# EAGLE design Actuator (EAGLE 9.6.2)

## Sheet 1 of 3: Connectors
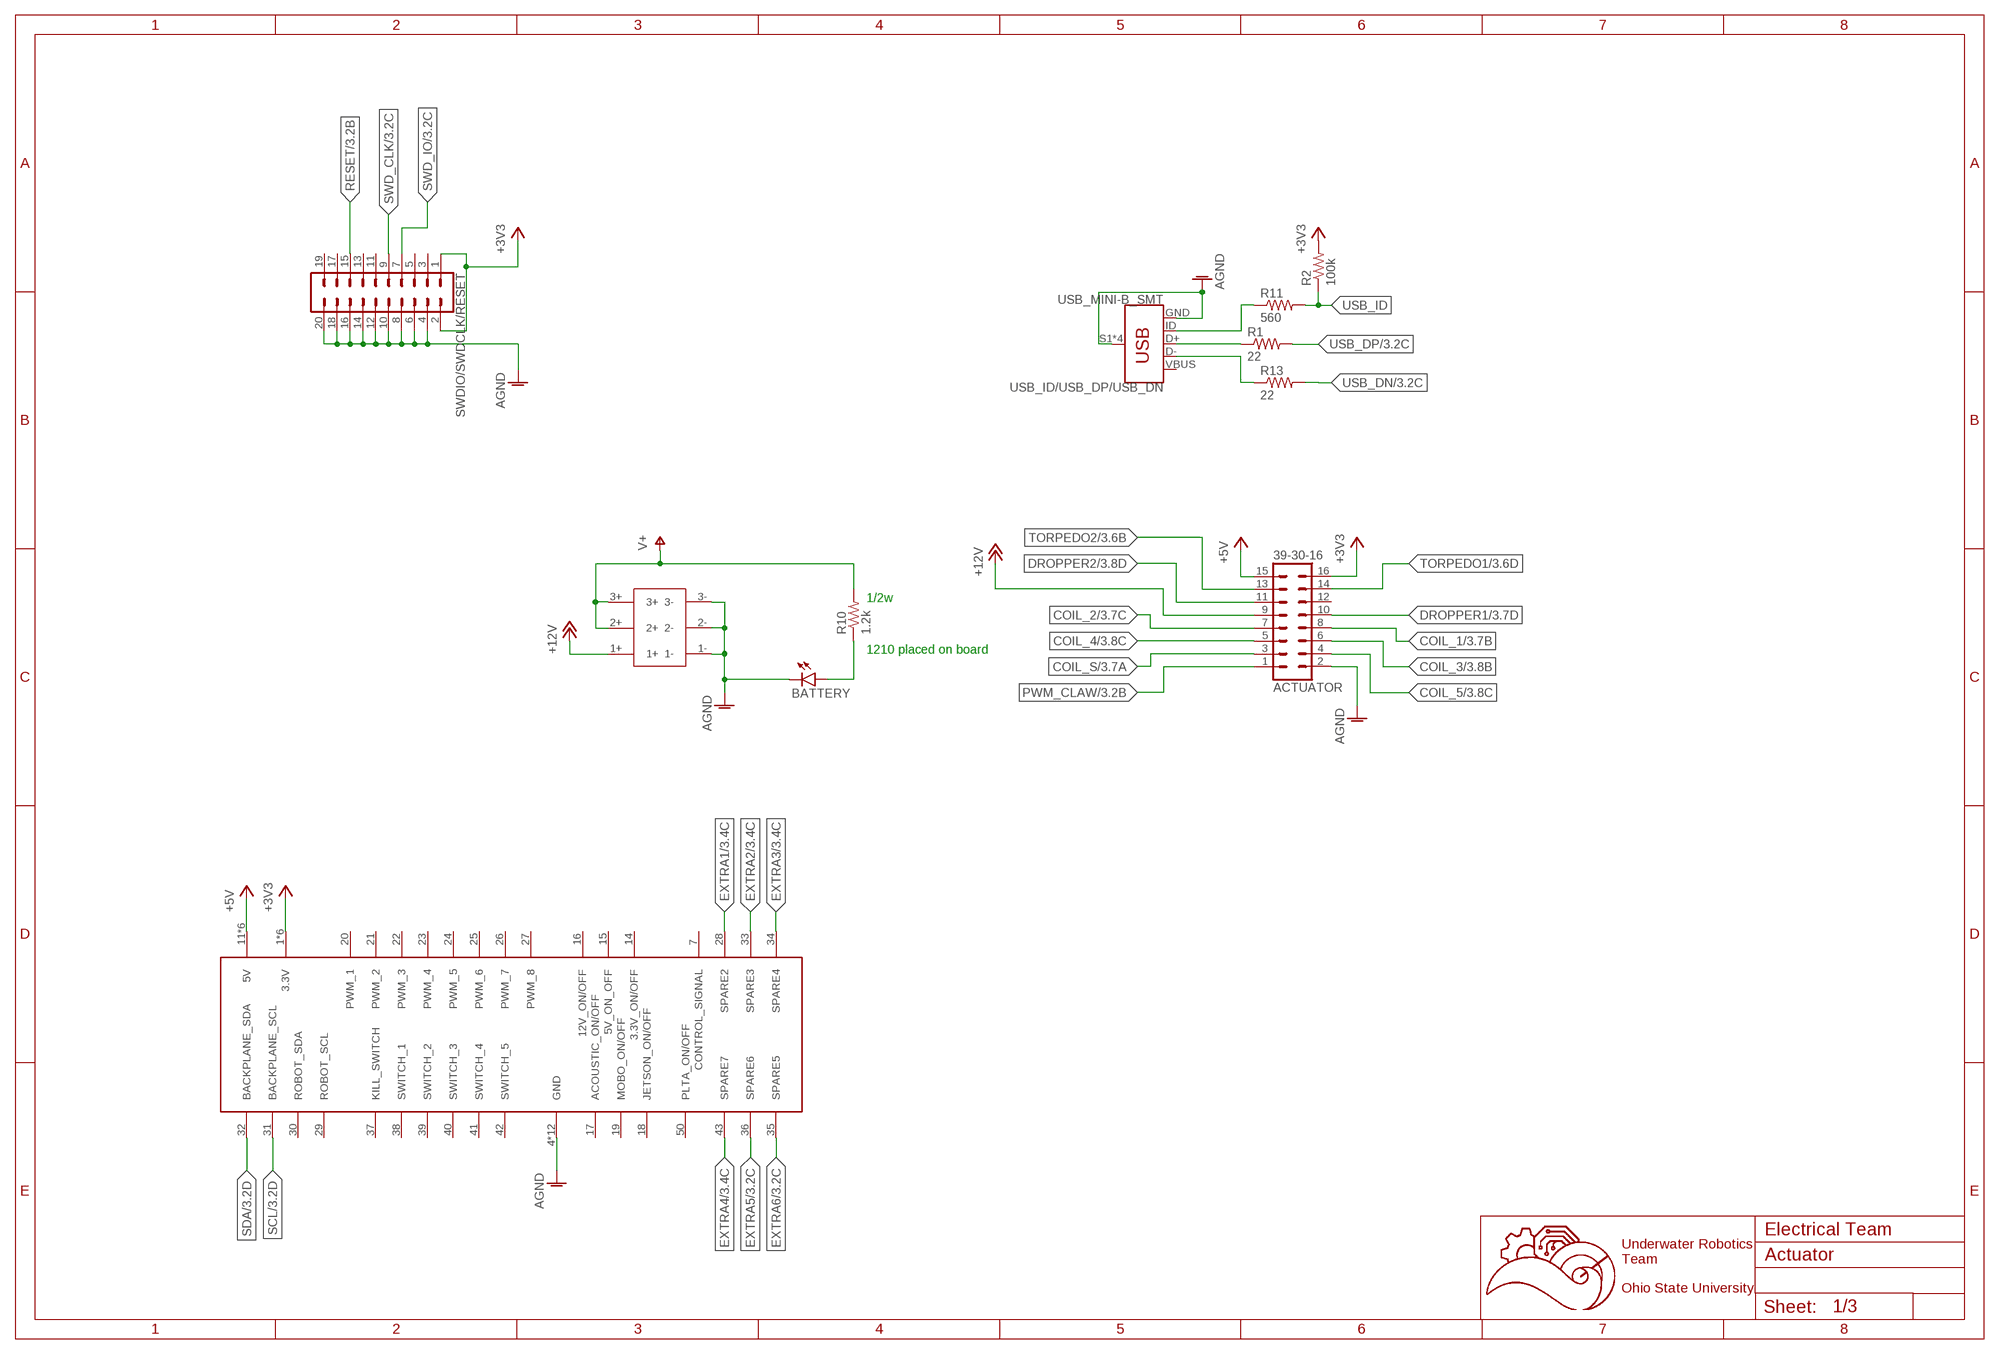
[diagram p0: schematic, sheet 1]

### Parts
ACTUATOR  39-30-16  [39-30-?16?]
BATTERY  LEDCHIPLED_0603  [CHIPLED_0603]
R1  22  R-US_R0603  [R0603]
R2  100k  R-US_R0603  [R0603]
R10  1.2k  R-US_R1210  [R1210]
R11  560  R-US_R0603  [R0603]
R13  22  R-US_R0603  [R0603]
SWDIO/SWDCLK/RESET  CONN_10X2  [2X10]
U$1  5530843-EDGE  [5530843-6-BOARDFINGERS]
U$3  6PIN-VERT  [6PIN_VERT]
USB_ID/USB_DP/USB_DN  USB_MINI-B_SMT  [USB-MINIB]

### Nets
+3V3: ACTUATOR.16 R2.2 SWDIO/SWDCLK/RESET.1 SWDIO/SWDCLK/RESET.2 U$1.1(3.3V) U$1.2(3.3V) U$1.3(3.3V) U$1.54(3.3V) U$1.55(3.3V) U$1.56(3.3V) ; also sheet 3
+5V: ACTUATOR.15 U$1.11(5V) U$1.12(5V) U$1.13(5V) U$1.44(5V) U$1.45(5V) U$1.46(5V)
+12V: ACTUATOR.9 U$3.1+ ; also sheet 3
AGND: ACTUATOR.2 BATTERY.C SWDIO/SWDCLK/RESET.4 SWDIO/SWDCLK/RESET.6 SWDIO/SWDCLK/RESET.8 SWDIO/SWDCLK/RESET.10 SWDIO/SWDCLK/RESET.12 SWDIO/SWDCLK/RESET.14 SWDIO/SWDCLK/RESET.16 SWDIO/SWDCLK/RESET.18 SWDIO/SWDCLK/RESET.20 U$1.4(GND) U$1.5(GND) U$1.6(GND) U$1.8(GND) U$1.9(GND) U$1.10(GND) U$1.47(GND) U$1.48(GND) U$1.49(GND) U$1.51(GND) U$1.52(GND) U$1.53(GND) U$3.1- U$3.2- U$3.3- USB_ID/USB_DP/USB_DN.GND USB_ID/USB_DP/USB_DN.S1(SHIELD) USB_ID/USB_DP/USB_DN.S2(SHIELD) USB_ID/USB_DP/USB_DN.S3(SHIELD) USB_ID/USB_DP/USB_DN.S4(SHIELD) ; also sheet 2,3
COIL_1: ACTUATOR.8 ; also sheet 3
COIL_2: ACTUATOR.7 ; also sheet 3
COIL_3: ACTUATOR.6 ; also sheet 3
COIL_4: ACTUATOR.5 ; also sheet 3
COIL_5: ACTUATOR.4 ; also sheet 3
COIL_S: ACTUATOR.3 ; also sheet 3
DROPPER1: ACTUATOR.10 ; also sheet 3
DROPPER2: ACTUATOR.11 ; also sheet 3
EXTRA1: U$1.28(SPARE2) ; also sheet 3
EXTRA2: U$1.33(SPARE3) ; also sheet 3
EXTRA3: U$1.34(SPARE4) ; also sheet 3
EXTRA4: U$1.43(SPARE7) ; also sheet 3
EXTRA5: U$1.36(SPARE6) ; also sheet 3
EXTRA6: U$1.35(SPARE5) ; also sheet 3
N$6: R11.1 USB_ID/USB_DP/USB_DN.ID
N$7: R1.1 USB_ID/USB_DP/USB_DN.D+
N$8: R13.1 USB_ID/USB_DP/USB_DN.D-
N$9: BATTERY.A R10.1
PWM_CLAW: ACTUATOR.1 ; also sheet 3
RESET: SWDIO/SWDCLK/RESET.15 ; also sheet 3
SCL: U$1.31(BACKPLANE_SCL) ; also sheet 3
SDA: U$1.32(BACKPLANE_SDA) ; also sheet 3
SWD_CLK: SWDIO/SWDCLK/RESET.9 ; also sheet 3
SWD_IO: SWDIO/SWDCLK/RESET.7 ; also sheet 3
TORPEDO1: ACTUATOR.14 ; also sheet 3
TORPEDO2: ACTUATOR.13 ; also sheet 3
USB_DN: R13.2 ; also sheet 3
USB_DP: R1.2 ; also sheet 3
USB_ID: R2.1 R11.2
V+: R10.2 U$3.2+ U$3.3+ ; also sheet 2
Unconnected: ACTUATOR.12 SWDIO/SWDCLK/RESET.3 SWDIO/SWDCLK/RESET.5 SWDIO/SWDCLK/RESET.11 SWDIO/SWDCLK/RESET.13 SWDIO/SWDCLK/RESET.17 SWDIO/SWDCLK/RESET.19 U$1.7(CONTROL_SIGNAL) U$1.14(3.3V_ON/OFF) U$1.15(5V_ON_OFF) U$1.16(12V_ON/OFF) U$1.17(ACOUSTIC_ON/OFF) U$1.18(JETSON_ON/OFF) U$1.19(MOBO_ON/OFF) U$1.20(PWM_1) U$1.21(PWM_2) U$1.22(PWM_3) U$1.23(PWM_4) U$1.24(PWM_5) U$1.25(PWM_6) U$1.26(PWM_7) U$1.27(PWM_8) U$1.29(ROBOT_SCL) U$1.30(ROBOT_SDA) U$1.37(KILL_SWITCH) U$1.38(SWITCH_1) U$1.39(SWITCH_2) U$1.40(SWITCH_3) U$1.41(SWITCH_4) U$1.42(SWITCH_5) U$1.50(PLTA_ON/OFF)

### Notes on the sheet
- 1/2w
- 1210 placed on board
- Electrical Team
- Underwater Robotics
  Team
  
  Ohio State University

## Sheet 2 of 3
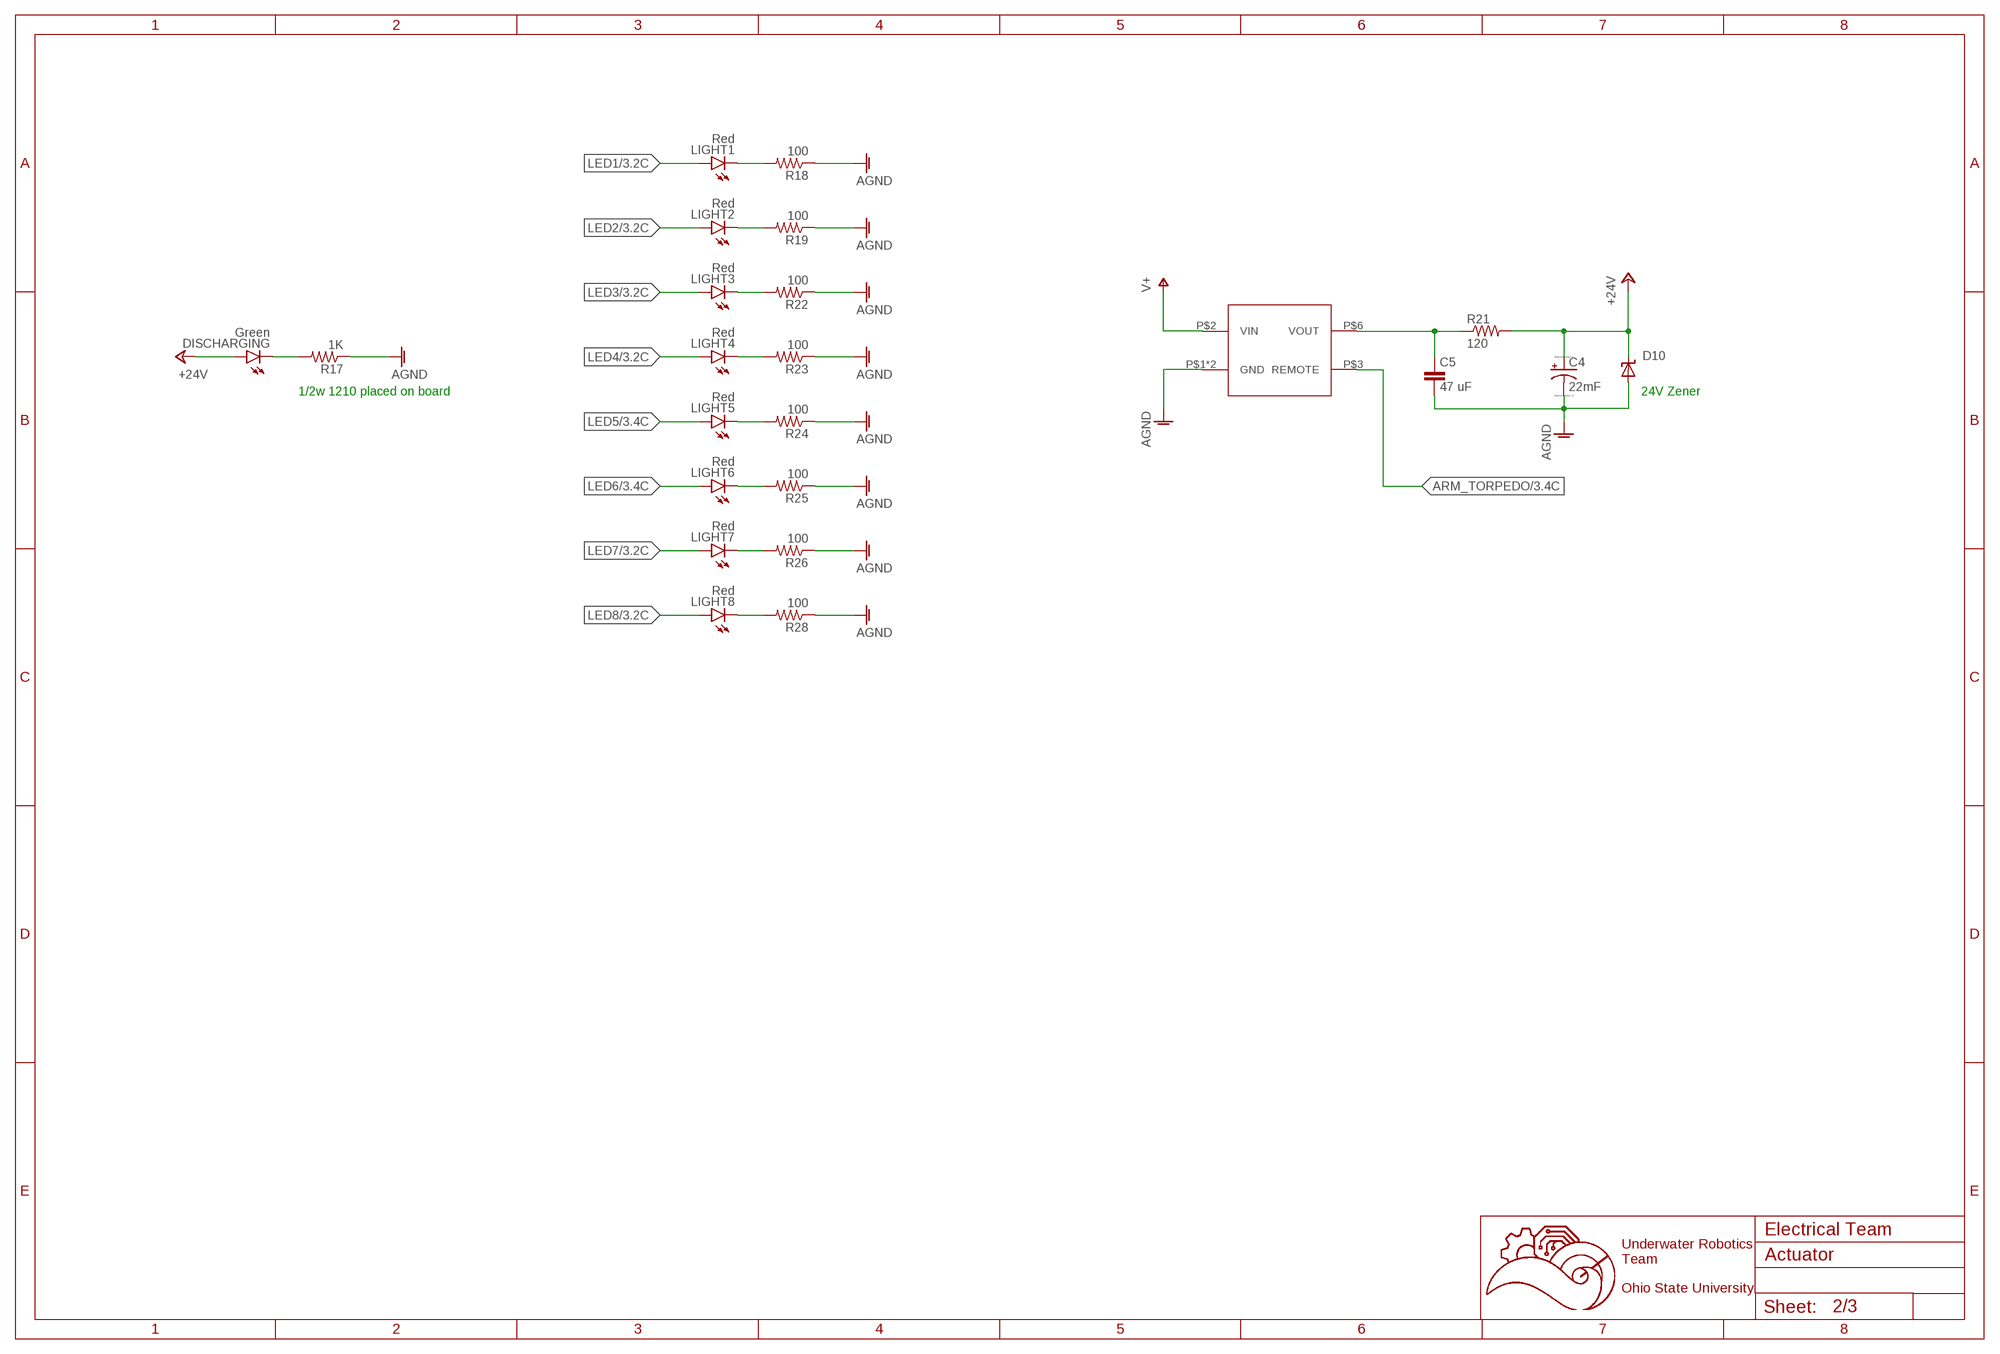
[diagram p1: schematic, sheet 2]

### Parts
C4  22mF  CPOL-USE10-30  [EB30D]
C5  47 uF  C-EUC0603  [C0603]
D10  SUPPRESSOR-SMBJ  [SMBJ]
DISCHARGING  Green  LEDCHIPLED_0603  [CHIPLED_0603]
LIGHT1  Red  LEDCHIPLED_0603  [CHIPLED_0603]
LIGHT2  Red  LEDCHIPLED_0603  [CHIPLED_0603]
LIGHT3  Red  LEDCHIPLED_0603  [CHIPLED_0603]
LIGHT4  Red  LEDCHIPLED_0603  [CHIPLED_0603]
LIGHT5  Red  LEDCHIPLED_0603  [CHIPLED_0603]
LIGHT6  Red  LEDCHIPLED_0603  [CHIPLED_0603]
LIGHT7  Red  LEDCHIPLED_0603  [CHIPLED_0603]
LIGHT8  Red  LEDCHIPLED_0603  [CHIPLED_0603]
R17  1K  R-US_R1210  [R1210]
R18  100  R-US_R0603  [R0603]
R19  100  R-US_R0603  [R0603]
R21  120  R-US_R6332W  [R6332W]
R22  100  R-US_R0603  [R0603]
R23  100  R-US_R0603  [R0603]
R24  100  R-US_R0603  [R0603]
R25  100  R-US_R0603  [R0603]
R26  100  R-US_R0603  [R0603]
R28  100  R-US_R0603  [R0603]
U$6  TMR6-2415  [TMR6-2415]

### Nets
+24V: C4.+ D10.C DISCHARGING.A R21.2 ; also sheet 3
AGND: C4.- C5.2 D10.A R17.1 R18.1 R19.1 R22.1 R23.1 R24.1 R25.1 R26.1 R28.1 U$6.P$1(GND) U$6.P$7(GND) ; also sheet 1,3
ARM_TORPEDO: U$6.P$3(REMOTE) ; also sheet 3
LED1: LIGHT1.A ; also sheet 3
LED2: LIGHT2.A ; also sheet 3
LED3: LIGHT3.A ; also sheet 3
LED4: LIGHT4.A ; also sheet 3
LED5: LIGHT5.A ; also sheet 3
LED6: LIGHT6.A ; also sheet 3
LED7: LIGHT7.A ; also sheet 3
LED8: LIGHT8.A ; also sheet 3
N$15: DISCHARGING.C R17.2
N$16: LIGHT1.C R18.2
N$17: LIGHT2.C R19.2
N$18: LIGHT3.C R22.2
N$19: LIGHT4.C R23.2
N$21: LIGHT5.C R24.2
N$22: LIGHT6.C R25.2
N$23: LIGHT7.C R26.2
N$24: LIGHT8.C R28.2
N$26: C5.1 R21.1 U$6.P$6(VOUT)
V+: U$6.P$2(VIN) ; also sheet 1

### Notes on the sheet
- 1/2w 1210 placed on board | 24V Zener
- Electrical Team
- Underwater Robotics
  Team
  
  Ohio State University

## Sheet 3 of 3
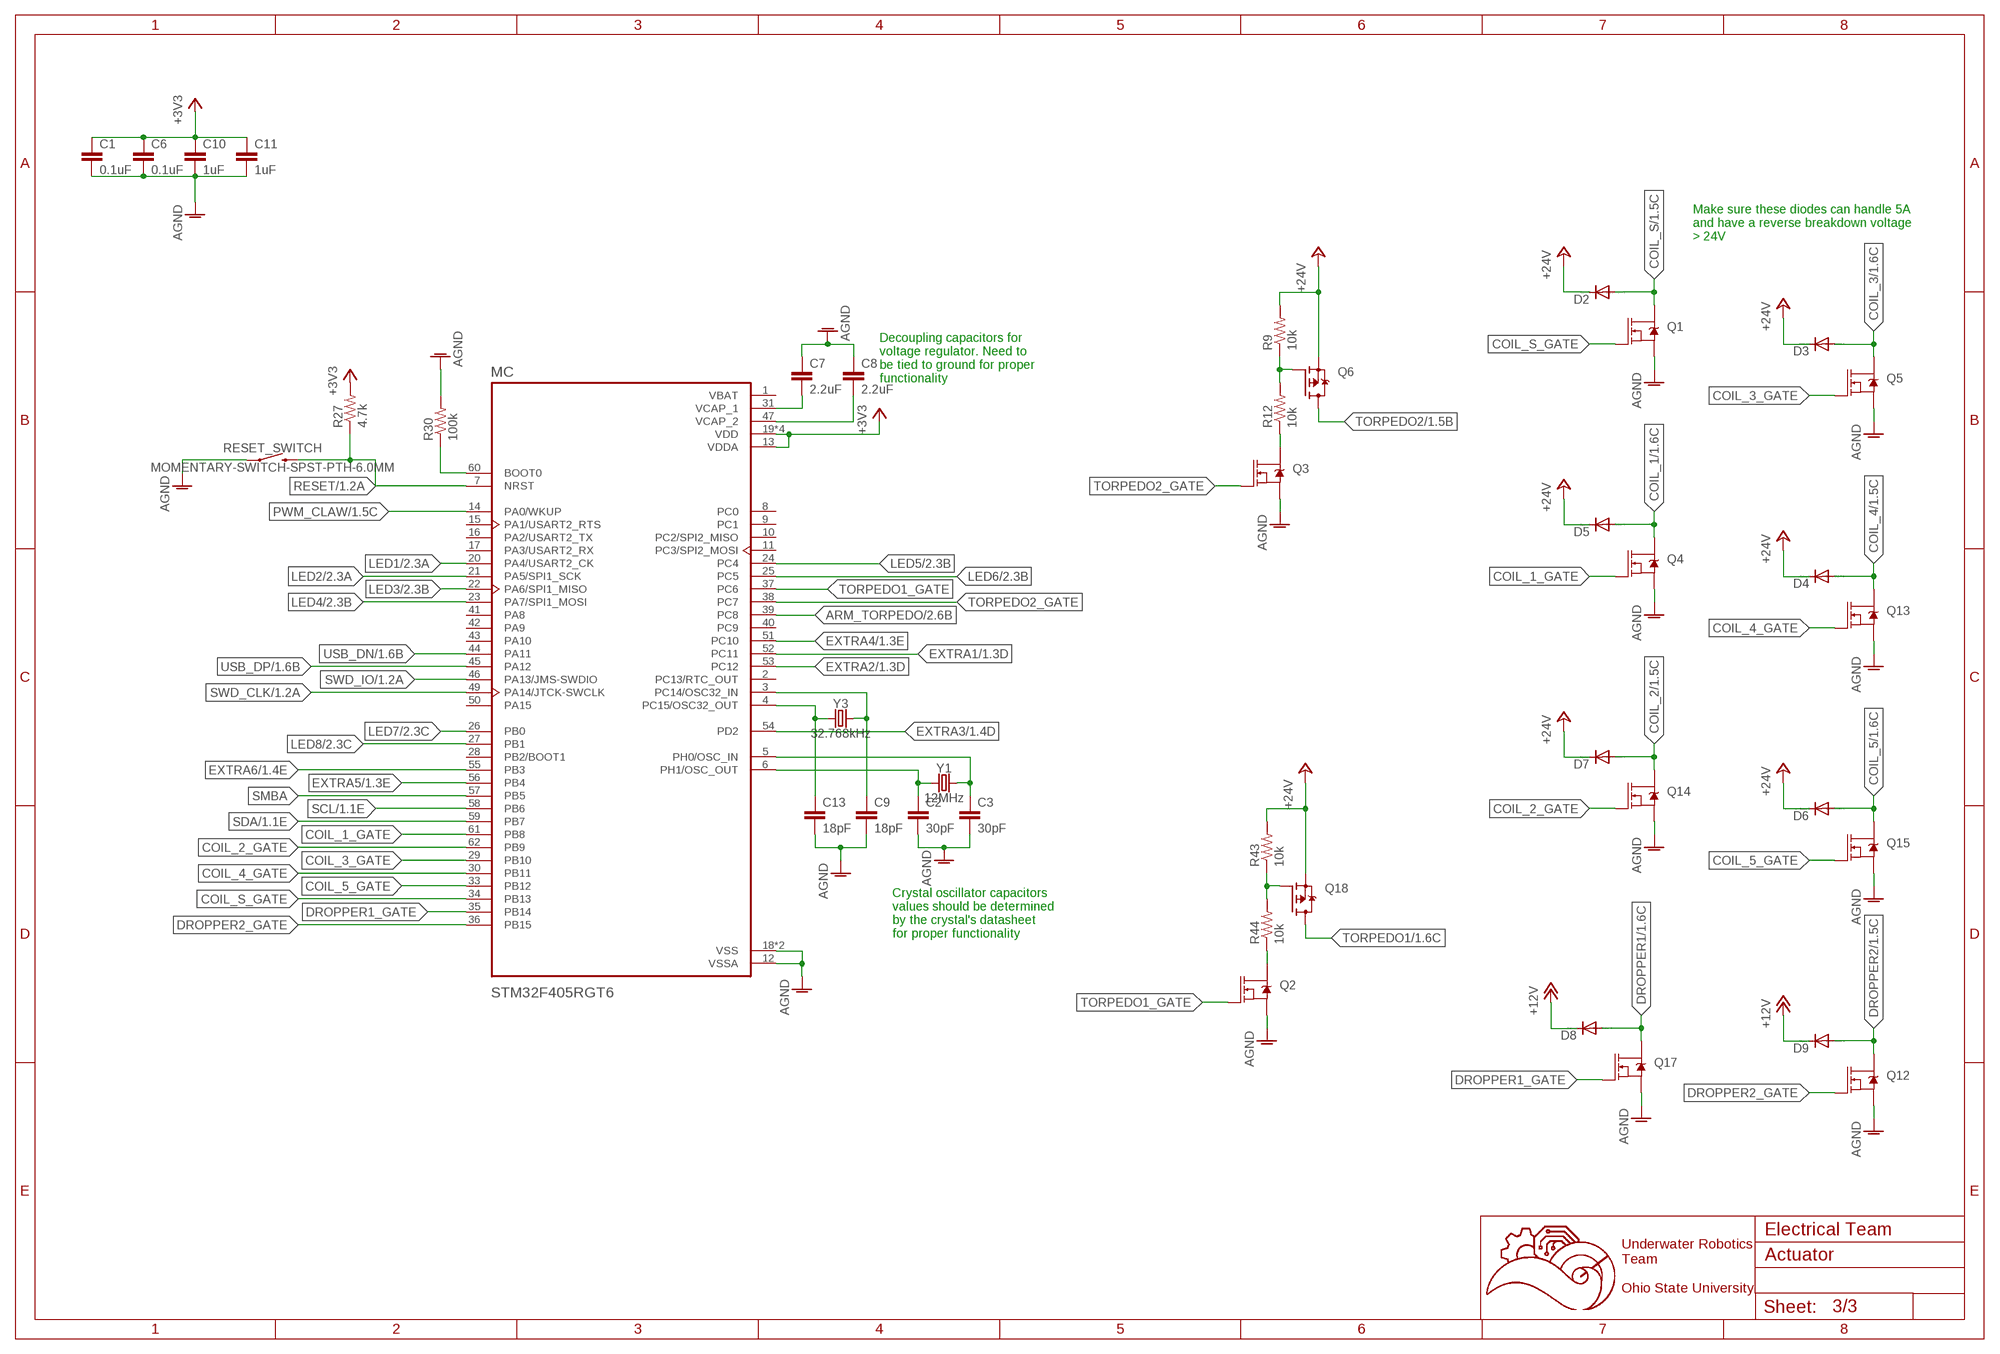
[diagram p2: schematic, sheet 3]

### Parts
C1  0.1uF  C-EUC0603  [C0603]
C2  30pF  C-EUC0603  [C0603]
C3  30pF  C-EUC0603  [C0603]
C6  0.1uF  C-EUC0603  [C0603]
C7  2.2uF  C-EUC0603  [C0603]
C8  2.2uF  C-EUC0603  [C0603]
C9  18pF  C-EUC0603  [C0603]
C10  1uF  C-EUC0603  [C0603]
C11  1uF  C-EUC0603  [C0603]
C13  18pF  C-EUC0603  [C0603]
D2  DIODE-SMB  [SMB]
D3  DIODE-SMB  [SMB]
D4  DIODE-SMB  [SMB]
D5  DIODE-SMB  [SMB]
D6  DIODE-SMB  [SMB]
D7  DIODE-SMB  [SMB]
D8  DIODE-SMB  [SMB]
D9  DIODE-SMB  [SMB]
MC  STM32F405RGT6  [QFP50P1200X1200X160-64N]
Q1  MOSFET-NCH-AO3404A  [SOT23-3]
Q2  MOSFET-NCH-AO3404A  [SOT23-3]
Q3  MOSFET-NCH-AO3404A  [SOT23-3]
Q4  MOSFET-NCH-AO3404A  [SOT23-3]
Q5  MOSFET-NCH-AO3404A  [SOT23-3]
Q6  FDD4141TO252  [TO252]
Q12  MOSFET-NCH-AO3404A  [SOT23-3]
Q13  MOSFET-NCH-AO3404A  [SOT23-3]
Q14  MOSFET-NCH-AO3404A  [SOT23-3]
Q15  MOSFET-NCH-AO3404A  [SOT23-3]
Q17  MOSFET-NCH-AO3404A  [SOT23-3]
Q18  FDD4141TO252  [TO252]
R9  10k  R-US_R0603  [R0603]
R12  10k  R-US_R0603  [R0603]
R27  4.7k  R-US_R0603  [R0603]
R30  100k  R-US_R0603  [R0603]
R43  10k  R-US_R0603  [R0603]
R44  10k  R-US_R0603  [R0603]
RESET_SWITCH  MOMENTARY-SWITCH-SPST-PTH-6.0MM  [TACTILE_SWITCH_PTH_6.0MM]
Y1  12MHz  CRYSTAL-16MHZPTH-HC49US  [HC49US]
Y3  32.768kHz  CRYSTAL-32.768KHZSMD-3.2X1.5  [CRYSTAL-SMD-3.2X1.5MM]

### Nets
+3V3: C1.1 C6.1 C10.1 C11.1 MC.13(VDDA) MC.19(VDD) MC.32(VDD) MC.48(VDD) MC.64(VDD) R27.2 ; also sheet 1
+12V: D8.C D9.C ; also sheet 1
+24V: D2.C D3.C D4.C D5.C D6.C D7.C Q6.2(S) Q18.2(S) R9.2 R43.2 ; also sheet 2
AGND: C1.2 C2.2 C3.2 C6.2 C7.1 C8.1 C9.2 C10.2 C11.2 C13.2 MC.12(VSSA) MC.18(VSS) MC.63(VSS) Q1.2(S) Q2.2(S) Q3.2(S) Q4.2(S) Q5.2(S) Q12.2(S) Q13.2(S) Q14.2(S) Q15.2(S) Q17.2(S) R30.2 RESET_SWITCH.1 ; also sheet 1,2
ARM_TORPEDO: MC.39(PC8) ; also sheet 2
COIL_1: D5.A Q4.3(D) ; also sheet 1
COIL_1_GATE: MC.61(PB8) Q4.1(G)
COIL_2: D7.A Q14.3(D) ; also sheet 1
COIL_2_GATE: MC.62(PB9) Q14.1(G)
COIL_3: D3.A Q5.3(D) ; also sheet 1
COIL_3_GATE: MC.29(PB10) Q5.1(G)
COIL_4: D4.A Q13.3(D) ; also sheet 1
COIL_4_GATE: MC.30(PB11) Q13.1(G)
COIL_5: D6.A Q15.3(D) ; also sheet 1
COIL_5_GATE: MC.33(PB12) Q15.1(G)
COIL_S: D2.A Q1.3(D) ; also sheet 1
COIL_S_GATE: MC.34(PB13) Q1.1(G)
DROPPER1: D8.A Q17.3(D) ; also sheet 1
DROPPER1_GATE: MC.35(PB14) Q17.1(G)
DROPPER2: D9.A Q12.3(D) ; also sheet 1
DROPPER2_GATE: MC.36(PB15) Q12.1(G)
EXTRA1: MC.52(PC11) ; also sheet 1
EXTRA2: MC.53(PC12) ; also sheet 1
EXTRA3: MC.54(PD2) ; also sheet 1
EXTRA4: MC.51(PC10) ; also sheet 1
EXTRA5: MC.56(PB4) ; also sheet 1
EXTRA6: MC.55(PB3) ; also sheet 1
LED1: MC.20(PA4/USART2_CK) ; also sheet 2
LED2: MC.21(PA5/SPI1_SCK) ; also sheet 2
LED3: MC.22(PA6/SPI1_MISO) ; also sheet 2
LED4: MC.23(PA7/SPI1_MOSI) ; also sheet 2
LED5: MC.24(PC4) ; also sheet 2
LED6: MC.25(PC5) ; also sheet 2
LED7: MC.26(PB0) ; also sheet 2
LED8: MC.27(PB1) ; also sheet 2
N$1: C2.1 MC.6(PH1/OSC_OUT) Y1.1
N$2: C3.1 MC.5(PH0/OSC_IN) Y1.2
N$3: C8.2 MC.47(VCAP_2)
N$5: C13.1 MC.4(PC15/OSC32_OUT) Y3.P$1
N$11: C7.2 MC.31(VCAP_1)
N$14: Q2.3(D) R44.1
N$20: Q18.1(G) R43.1 R44.2
N$25: Q6.1(G) R9.1 R12.2
N$28: Q3.3(D) R12.1
N$29: C9.1 MC.3(PC14/OSC32_IN) Y3.P$2
N$30: MC.60(BOOT0) R30.1
PWM_CLAW: MC.14(PA0/WKUP) ; also sheet 1
RESET: MC.7(NRST) R27.1 RESET_SWITCH.3 ; also sheet 1
SCL: MC.58(PB6) ; also sheet 1
SDA: MC.59(PB7) ; also sheet 1
SMBA: MC.57(PB5)
SWD_CLK: MC.49(PA14/JTCK-SWCLK) ; also sheet 1
SWD_IO: MC.46(PA13/JMS-SWDIO) ; also sheet 1
TORPEDO1: Q18.3(D) ; also sheet 1
TORPEDO1_GATE: MC.37(PC6) Q2.1(G)
TORPEDO2: Q6.3(D) ; also sheet 1
TORPEDO2_GATE: MC.38(PC7) Q3.1(G)
USB_DN: MC.44(PA11) ; also sheet 1
USB_DP: MC.45(PA12) ; also sheet 1
Unconnected: MC.2(PC13/RTC_OUT) MC.8(PC0) MC.9(PC1) MC.10(PC2/SPI2_MISO) MC.11(PC3/SPI2_MOSI) MC.15(PA1/USART2_RTS) MC.16(PA2/USART2_TX) MC.17(PA3/USART2_RX) MC.28(PB2/BOOT1) MC.40(PC9) MC.41(PA8) MC.42(PA9) MC.43(PA10) MC.50(PA15)

### Notes on the sheet
- Make sure these diodes can handle 5A
  and have a reverse breakdown voltage
  > 24V
- Decoupling capacitors for 
  voltage regulator. Need to
  be tied to ground for proper
  functionality
- Crystal oscillator capacitors
  values should be determined
  by the crystal's datasheet
  for proper functionality
- Electrical Team
- Underwater Robotics
  Team
  
  Ohio State University

## Power pins joined to a net without a drawn wire
VBAT: MC.1(VBAT)
VBUS: USB_ID/USB_DP/USB_DN.VBUS

## Library data of the parts
ACTUATOR = con-molex-mini-fit:39-30-?16?: HEADER
BATTERY DISCHARGING LIGHT1-LIGHT8 = led:LED: LED OSRAM: - CHIPLED LG R971, LG N971, LY N971, LG Q971, LY Q971, LO R971, LY R971 LH N974, LH R974 LS Q976, LO Q976, LY Q976 LO Q996 - Hyper CHIPLED LW Q18S LB Q993, LB Q99A, LB R99A - SideLED LS A670, LO A670, LY A670, LG A670, LP A670 LB A673, LV A673, LT A673, LW A673 LH A674 LY A675 LS A676, LA A676, LO A676, LY A676, LW A676 LS A679, LY A679, LG A679 - Hyper Micro SIDELED® LS Y876, LA Y876, LO Y876, LY Y876 LT Y87S - SmartLED LW L88C, LW L88S LB L89C, LB L89S, LG L890 LS L89K, LO L89K, LY L89K LS L896, LA L896, LO L896, LY L896 - TOPLED LS T670, LO T670, LY T670, LG T670, LP T670 LSG T670, LSP T670, LSY T670, LOP T670, LYG T670 LG T671, LOG T671, LSG T671 LB T673, LV T673, LT T673, LW T673 LH T674 LS T676, LA T676, LO T676, LY T676, LB T676, LH T676, LSB T676, LW T676 LB T67C, LV T67C, LT T67C, LS T67K, LO T67K, LY T67K, LW E67C LS E67B, LA E67B, LO E67B, LY E67B, LB E67C, LV E67C, LT E67C LW T67C LS T679, LY T679, LG T679 LS T770, LO T770, LY T770, LG T770, LP T770 LB T773, LV T773, LT T773, LW T773 LH T774 LS E675, LA E675, LY E675, LS T675 LS T776, LA T776, LO T776, LY T776, LB T776 LHGB T686 LT T68C, LB T68C - Hyper Mini TOPLED® LB M676 - Mini TOPLED Santana® LG M470 LS M47K, LO M47K, LY M47K Source: http://www.osram.convergy.de LUXEON: - LUMILED® LXK2-PW12-R00, LXK2-PW12-S00, LXK2-PW14-U00, LXK2-PW14-V00 LXK2-PM12-R00, LXK2-PM12-S00, LXK2-PM14-U00 LXK2-PE12-Q00, LXK2-PE12-R00, LXK2-PE12-S00, LXK2-PE14-T00, LXK2-PE14-U00 LXK2-PB12-K00, LXK2-PB12-L00, LXK2-PB12-M00, LXK2-PB14-N00, LXK2-PB14-P00, LXK2-PB14-Q00 LXK2-PR12-L00, LXK2-PR12-M00, LXK2-PR14-Q00, LXK2-PR14-R00 LXK2-PD12-Q00, LXK2-PD12-R00, LXK2-PD12-S00 LXK2-PH12-R00, LXK2-PH12-S00 LXK2-PL12-P00, LXK2-PL12-Q00, LXK2-PL12-R00 Source: www.luxeon.com KINGBRIGHT: KA-3528ASYC Source: www.kingbright.com
C1-C3 C5-C11 C13 = rcl:C-EU: CAPACITOR, European symbol; SPICEPREFIX: C
C4 = resistor:CPOL-US: POLARIZED CAPACITOR, American symbol
D2-D9 = diode:DIODE-: DIODE
D10 = diode:SUPPRESSOR-: Suppressor diode
MC = STM32F405RGT6:STM32F405RGT6: High-performance foundation line, ARM Cortex-M4 core with DSP and FPU, 1 Mbyte Flash, 168 MHz CPU, ART Accelerator; AVAILABILITY: Unavailable; DESCRIPTION: High-performance foundation line, ARM Cortex-M4 core with DSP and FPU, 1 Mbyte Flash, 168 MHz CPU, ART Accelerator; MF: STMicroelectronics; MP: STM32F405RGT6; PACKAGE: LQFP-64 STMicroelectronics; PRICE: None
Q1-Q5 Q12-Q15 Q17 = SparkFun-DiscreteSemi:MOSFET-NCH: N-channel MOSFETs Voltage controlled devices that allow control of high current outputs. SparkFun Products: SparkFun OpenScale <https://www.sparkfun.com/products/13261> SparkFun Digital Sandbox <https://www.sparkfun.com/products/12651> SparkFun Monster Moto Shield <https://www.sparkfun.com/products/10182> SparkFun MOSFET Power Controller <https://www.sparkfun.com/products/11214>; PROD_ID: TRANS-12988; VALUE: 5.8A/30V/35mΩ
Q6 Q18 = transistor-fet:FDD4141: P-Channel PowerTrench® MOSFET Source: FDD4141.pdf
R1 R2 R10 R11 R13 R17-R19 R22-R28 R30 = rcl:R-US_: RESISTOR, American symbol; SPICEPREFIX: R
R9 R12 R21 R43 R44 = resistor:R-US_: RESISTOR, American symbol
RESET_SWITCH = SparkFun-Switches:MOMENTARY-SWITCH-SPST: Momentary Switch (Pushbutton) - SPST Normally-open (NO) SPST momentary switches (buttons, pushbuttons). Variants PTH-12MM - 12mm square, through-hole Momentary Pushbutton Switch - 12mm Square <https://www.sparkfun.com/products/9190> (COM-09190) PTH-6.0MM, PTH-6.0MM-KIT - 6.0mm square, through-hole Mini Pushbutton Switch <https://www.sparkfun.com/products/97> (COM-00097) KIT package intended for soldering kit's - only one side of pads' copper is exposed. PTH-RIGHT-ANGLE-KIT - Right-angle, through-hole Right Angle Tactile Button <https://www.sparkfun.com/products/10791> - Used on SparkFun BigTime Watch Kit <https://www.sparkfun.com/products/11734> SMD-12MM - 12mm square, surface-mount Tactile Button - SMD (12mm) <https://www.sparkfun.com/products/12993> (COM-12993) Used on SparkFun PicoBoard <https://www.sparkfun.com/products/11888> SMD-4.5MM - 4.5mm Square Trackball Switch Used on SparkFun Blackberry Trackballer Breakout <https://www.sparkfun.com/products/13169> SMD-4.6MMX2.8MM - 4.60mm x 2.80mm, surface mount Used on SparkFun SAMD21 Mini Breakout <https://www.sparkfun.com/products/13664> SMD-5.2MM, SMD-5.2-REDUNDANT - 5.2mm square, surface-mount Mini Pushbutton Switch - SMD <https://www.sparkfun.com/products/8720> (COM-08720) Used on Arduino Pro Mini <https://www.sparkfun.com/products/11114> REDUNDANT package connects both switch circuits together SMD-6.0X3.5MM - 6.0 x 3.5mm, surface mount Momentary Reset Switch SMD <https://www.sparkfun.com/products/8229> (COM-08229) SMD-6.2MM-TALL - 6.2mm square, surface mount Tactile Button - SMD (6mm) <https://www.sparkfun.com/products/12992> Used on SparkFun Digital Sandbox <https://www.sparkfun.com/products/12651> SMD-RIGHT-ANGLE - Right-angle, surface mount Used on SparkFun Block for Intel® Edison - Arduino <https://www.sparkfun.com/products/13036>; PROD_ID: SWCH-08441; SF_SKU: COM-00097
SWDIO/SWDCLK/RESET = SparkFun-Connectors:CONN_10X2: Multi connection point. Often used as Generic Header-pin footprint for 0.1 inch spaced/style header connections On any of the 0.1 inch spaced packages, you can populate with these: Break Away Headers - Straight <https://www.sparkfun.com/products/116> (PRT-00116) Break Away Male Headers - Right Angle <https://www.sparkfun.com/products/553> (PRT-00553) Female Headers <https://www.sparkfun.com/products/115> (PRT-00115) Break Away Headers - Machine Pin <https://www.sparkfun.com/products/117> (PRT-00117) Break Away Female Headers - Swiss Machine Pin <https://www.sparkfun.com/products/743> (PRT-00743) Special note about the "SPECIAL" package: This was SPECIALLY designed to be used with our Graphic LCD Backpack. Be sure you want to use this! It is not only staggered on each line of header holes, but IT IS ALSO offset of the center point of the top and bottom lines by 5 mil. This causes the headers to lock into place on the "standard" footprint on the LCD screen. The extra squares on the tdocu layer are there simply to reference other pins (if you were to actually populate a longer header than ten long - this is what we do with the backpacks).
U$1 = 5530843-6:5530843-EDGE
U$3 = Vertical_Connectors:6PIN-VERT
U$6 = converter:TMR6-2415
USB_ID/USB_DP/USB_DN = SparkFun-Connectors:USB_MINI-B: USB type Mini-B Connector Breaks out 5th pin, and includes shield pins if needed. SparkFun Products: SparkFun FTDI Basic Breakout <https://www.sparkfun.com/products/9716> SparkFun XBee Explorer USB <https://www.sparkfun.com/products/11812> SparkFun Redboard <https://www.sparkfun.com/products/12757>; PROD_ID: CONN-08193; SF_ID: PRT-00587
Y1 = SparkFun-Clocks:CRYSTAL-16MHZ: 16MHz Crystal Digikey Example <http://www.digikey.com/product-search/en?keywords=535-9122-1-ND> Frequency: 16MHz Frequency Stability: ±50ppm Frequency Tolerance: ±20ppm Load Capacitance: 18pF SparkFun Products: Pro Micro -5V/16MHz <https://www.sparkfun.com/products/12640> SparkFun Serial Enabled LCD Kit <https://www.sparkfun.com/products/10097>; PROD_ID: XTAL-08181; SF_ID: COM-00536; VALUE: 16MHz
Y3 = SparkFun-Clocks:CRYSTAL-32.768KHZ: 32.768kHz Crystal Frequency: 32.768kHz Frequency Stability: ±20ppm Load Capacitance: 12.5pF (PTH-2X6 & SMD-3.2X1.5), 6pF (SMD-2X6) SparkFun Products: SparkFun BigTime Watch Kit <https://www.sparkfun.com/products/11734> SparkFun nRF52832 Breakout <https://www.sparkfun.com/products/13990> SparkFun Real Time Clock Module <https://www.sparkfun.com/products/12708>; PROD_ID: XTAL-13062

## Board
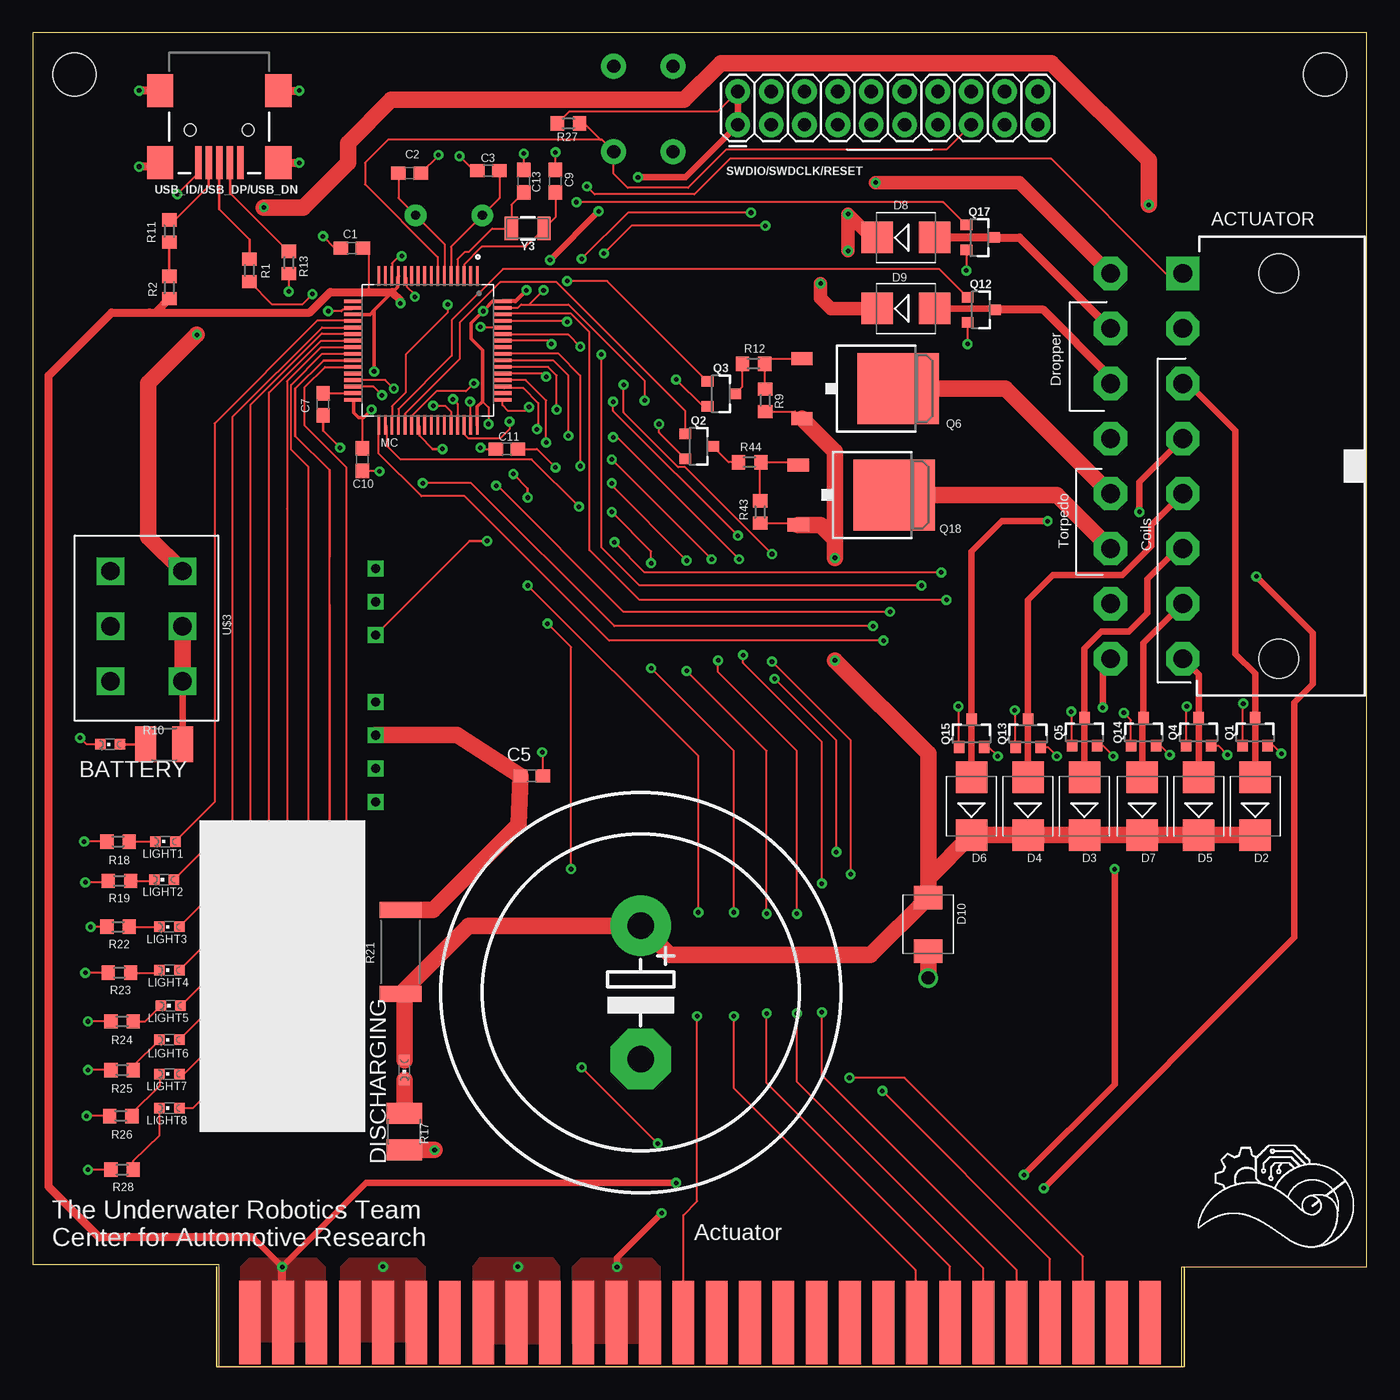
[diagram p3: board, top side]
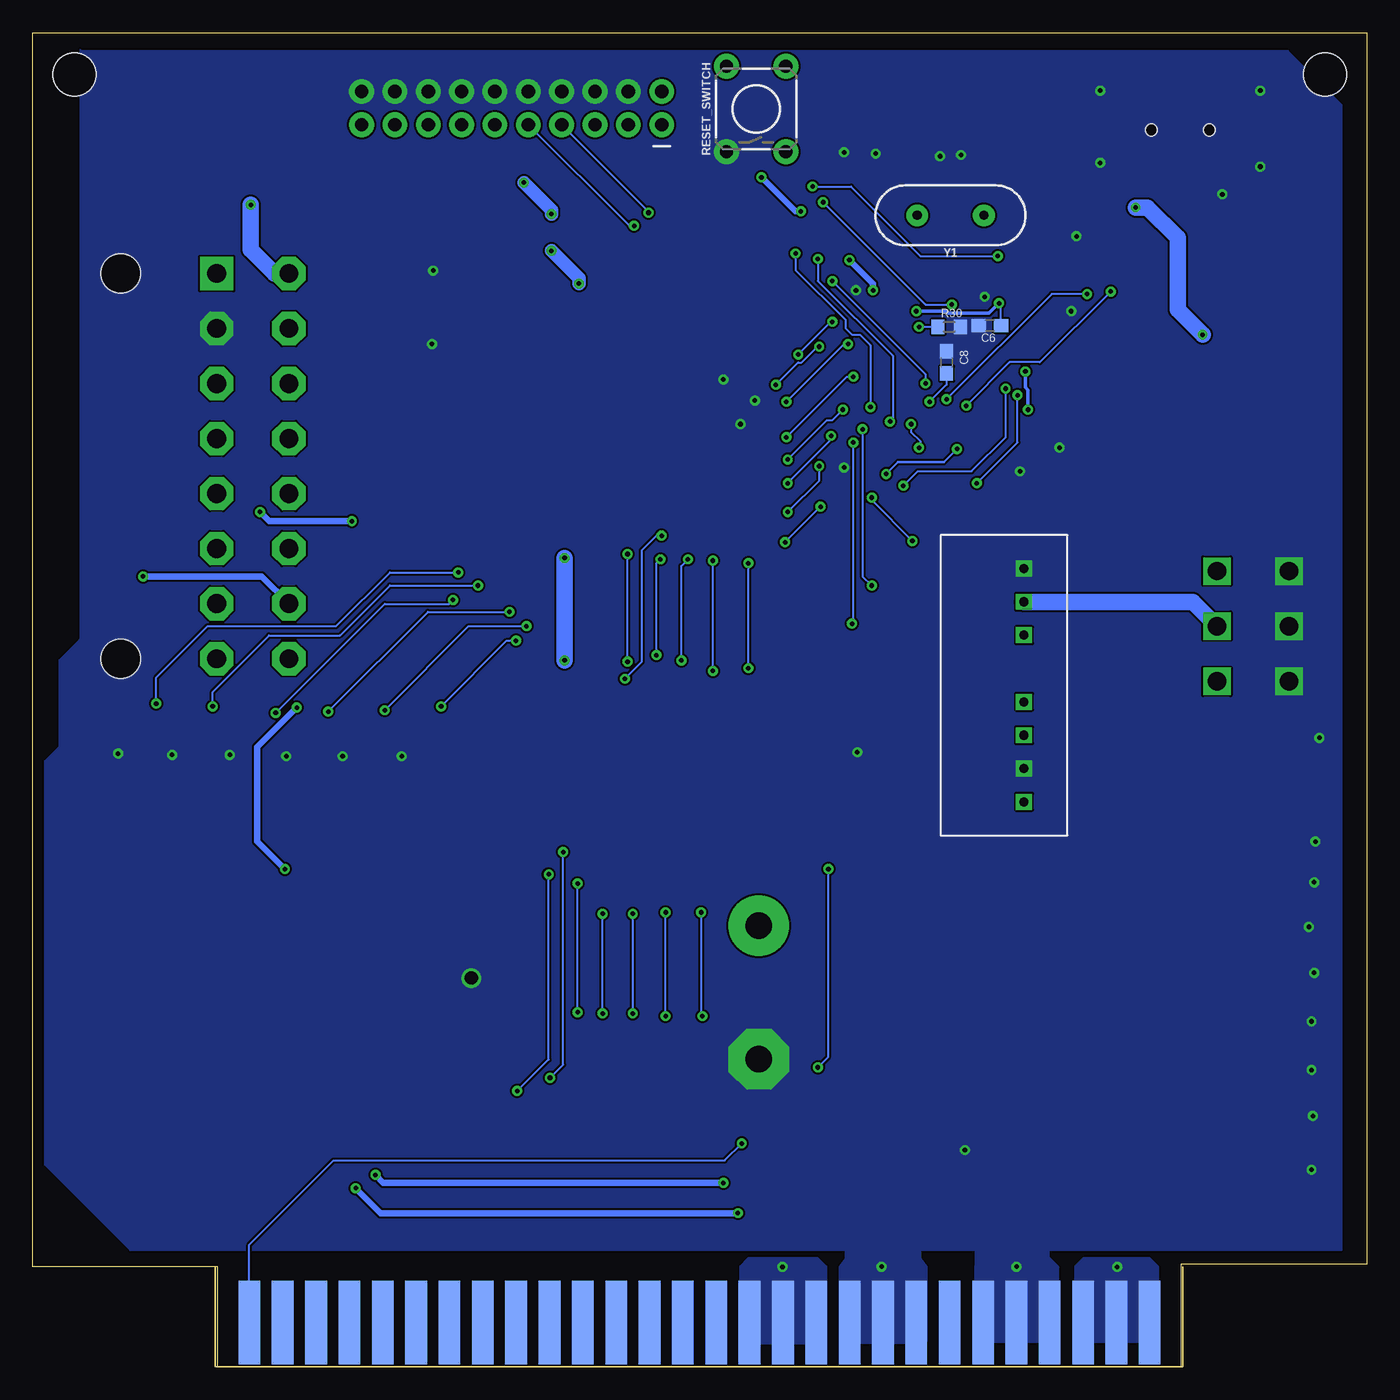
[diagram p4: board, bottom side, seen from below]

Size 101.6 x 101.6 mm. Coordinates in mm from the lower left corner, seen from the top.
Outline: 0,7.8 14.14,7.8 14.14,0 87.53,0 87.53,7.62 101.6,7.62 101.6,101.6 0,101.6 0,7.8
Copper layers (1*16): Top 0.035mm / dielectric 1.5mm / Bottom 0.035mm
Design rules "default *": minimum track width 6mil, minimum drill 0.35mm, track to track 6mil, track to pad 6mil, pad to pad 6mil, via to via 6mil, smd to smd 6mil, copper to edge 0.00508125mm, drill to drill 6mil, minimum pad ring 10mil, minimum via ring 8mil, stop-mask expansion 4mil, vias tented up to drill 0mil, thermal gap 10mil
Holes 3.26 mm at 3.17,98.42 98.42,98.42

### Footprints (pad centres in the part's own frame; a part is rotated, then mirrored left to right if it is on the bottom)
39-30-?16? = drill 1.422 pad 2.54 square: 1 14.668,0 | drill 1.422 pad 2.54 octagon: 2 10.477,0; 3 6.287,0; 4 2.095,0; 5 -2.095,0; 6 -6.287,0; 7 -10.477,0; 8 -14.668,0; 9 14.668,5.512; 10 10.477,5.512; 11 6.287,5.512; 12 2.095,5.512; 13 -2.095,5.512; 14 -6.287,5.512; 15 -10.477,5.512; 16 -14.668,5.512 | hole 3: -14.668,-7.3; 14.668,-7.3
CHIPLED_0603 = smd 0.8 x 0.8: A 0,-0.75; C 0,0.75
C0603 = smd 1.1 x 1: 1 -0.85,0; 2 0.85,0
EB30D = drill 2.007 pad 4.597: + -5.08,0 | drill 2.007 pad 4.597 octagon: - 5.08,0
SMB = smd 2.4 x 2.4: A 2.2,0; C -2.2,0
SMBJ = smd 1.78 x 2.16: A 2.04,0; C -2.03,0
QFP50P1200X1200X160-64N = smd 1.47 x 0.28: 1 -5.67,3.75; 2 -5.67,3.25; 3 -5.67,2.75; 4 -5.67,2.25; 5 -5.67,1.75; 6 -5.67,1.25; 7 -5.67,0.75; 8 -5.67,0.25; 9 -5.67,-0.25; 10 -5.67,-0.75; 11 -5.67,-1.25; 12 -5.67,-1.75; 13 -5.67,-2.25; 14 -5.67,-2.75; 15 -5.67,-3.25; 16 -5.67,-3.75; 33 5.67,-3.75; 34 5.67,-3.25; 35 5.67,-2.75; 36 5.67,-2.25; 37 5.67,-1.75; 38 5.67,-1.25; 39 5.67,-0.75; 40 5.67,-0.25; 41 5.67,0.25; 42 5.67,0.75; 43 5.67,1.25; 44 5.67,1.75; 45 5.67,2.25; 46 5.67,2.75; 47 5.67,3.25; 48 5.67,3.75 | smd 0.28 x 1.47: 17 -3.75,-5.67; 18 -3.25,-5.67; 19 -2.75,-5.67; 20 -2.25,-5.67; 21 -1.75,-5.67; 22 -1.25,-5.67; 23 -0.75,-5.67; 24 -0.25,-5.67; 25 0.25,-5.67; 26 0.75,-5.67; 27 1.25,-5.67; 28 1.75,-5.67; 29 2.25,-5.67; 30 2.75,-5.67; 31 3.25,-5.67; 32 3.75,-5.67; 49 3.75,5.67; 50 3.25,5.67; 51 2.75,5.67; 52 2.25,5.67; 53 1.75,5.67; 54 1.25,5.67; 55 0.75,5.67; 56 0.25,5.67; 57 -0.25,5.67; 58 -0.75,5.67; 59 -1.25,5.67; 60 -1.75,5.67; 61 -2.25,5.67; 62 -2.75,5.67; 63 -3.25,5.67; 64 -3.75,5.67
SOT23-3 = smd 0.8 x 0.9: 1 -0.95,-1; 2 0.95,-1; 3 0,1.1
TO252 = smd 1 x 1.6: 1 -2.28,-4.8; 2 2.28,-4.8 | smd 5.4 x 6.2: 3 0,2.5
R0603 = smd 1 x 1.1: 1 -0.85,0; 2 0.85,0
R1210 = smd 1.6 x 2.7: 1 -1.4,0; 2 1.4,0
R6332W = smd 1.2 x 3.2: 1 -3.196,0; 2 3.196,0
TACTILE_SWITCH_PTH_6.0MM = drill 1.016 pad 1.88: 1 -3.251,2.261; 2 3.251,2.261; 3 -3.251,-2.261; 4 3.251,-2.261
2X10 = drill 1.016 pad 1.88: 1 0,0; 2 0,2.54; 3 2.54,0; 4 2.54,2.54; 5 5.08,0; 6 5.08,2.54; 7 7.62,0; 8 7.62,2.54; 9 10.16,0; 10 10.16,2.54; 11 12.7,0; 12 12.7,2.54; 13 15.24,0; 14 15.24,2.54; 15 17.78,0; 16 17.78,2.54; 17 20.32,0; 18 20.32,2.54; 19 22.86,0; 20 22.86,2.54
5530843-6-BOARDFINGERS = smd 1.651 x 6.35 bottom: 1 0.826,3.375; 2 3.365,3.375; 3 5.905,3.375; 4 8.445,3.375; 5 10.986,3.375; 6 13.525,3.375; 7 16.066,3.375; 8 18.605,3.375; 9 21.145,3.375; 10 23.686,3.375; 11 26.226,3.375; 12 28.765,3.375; 13 31.305,3.375; 14 33.846,3.375; 15 36.386,3.375; 16 38.925,3.375; 17 41.465,3.375; 18 44.005,3.375; 19 46.545,3.375; 20 49.086,3.375; 21 51.626,3.375; 22 54.166,3.375; 23 56.706,3.375; 24 59.245,3.375; 25 61.785,3.375; 26 64.326,3.375; 27 66.865,3.375; 28 69.406,3.375 | smd 1.651 x 6.35: 29 69.406,3.375; 30 66.865,3.375; 31 64.326,3.375; 32 61.785,3.375; 33 59.245,3.375; 34 56.706,3.375; 35 54.166,3.375; 36 51.626,3.375; 37 49.086,3.375; 38 46.545,3.375; 39 44.005,3.375; 40 41.465,3.375; 41 38.925,3.375; 42 36.386,3.375; 43 33.846,3.375; 44 31.305,3.375; 45 28.765,3.375; 46 26.226,3.375; 47 23.686,3.375; 48 21.145,3.375; 49 18.605,3.375; 50 16.066,3.375; 51 13.525,3.375; 52 10.986,3.375; 53 8.445,3.375; 54 5.905,3.375; 55 3.365,3.375; 56 0.826,3.375
6PIN_VERT = drill 1.4 square: 1+ 0,0; 1- 5.5,0; 2+ 0,4.2; 2- 5.5,4.2; 3+ 0,8.4; 3- 5.5,8.4
TMR6-2415 = drill 0.7 square: P$1 0,0; P$2 2.54,0; P$3 5.08,0; P$5 10.16,0; P$6 12.7,0; P$7 15.24,0; P$8 17.78,0
USB-MINIB = smd 2.5 x 0.5: D+ 2.5,0; D- 2.5,0.8; GND 2.5,-1.6; ID 2.5,-0.8; VBUS 2.5,1.6 | smd 2.5 x 2: S1 -3,4.5; S2 2.5,4.5; S3 -3,-4.5; S4 2.5,-4.5 | hole 0.9: 0,2.2; 0,-2.2
HC49US = drill 0.7 pad 1.651: 1 -2.54,0; 2 2.54,0
CRYSTAL-SMD-3.2X1.5MM = smd 1 x 1.8: P$1 -1.25,0; P$2 1.25,0

### Placement (x,y rotation side)
ACTUATOR  39-30-16?  [39-30-?16?]  87.6,68.6 90 top
BATTERY  5.9,47.4 90 top
C1  24.3,85.2 180 top
C2  28.7,90.9 0 top
C3  34.7,91.1 180 top
C4  46.3,28.5 270 top
C5  38,45 0 top
C6  28.7,79.3 180 bottom
C7  22.1,73.3 90 top
C8  32,76.5 270 bottom
C9  39.8,90.3 90 top
C10  25.1,69.1 270 top
C11  36.1,69.9 0 top
C13  37.4,90.3 90 top
D2  93.1,42.7 90 top
D3  80.1,42.7 90 top
D4  75.8,42.7 90 top
D5  88.8,42.7 90 top
D6  71.5,42.7 90 top
D7  84.5,42.7 90 top
D8  66.5,86 0 top
D9  66.5,80.6 0 top
D10  68.2,33.7 270 top
DISCHARGING  28.3,22.6 180 top
LIGHT1  10.1,40 90 top
LIGHT2  10,37.1 90 top
LIGHT3  10.4,33.5 90 top
LIGHT4  10.4,30.2 90 top
LIGHT5  10.5,27.5 90 top
LIGHT6  10.4,24.9 90 top
LIGHT7  10.4,22.3 90 top
LIGHT8  10.4,19.7 90 top
MC  30.1,77.4 270 top
Q1  93.1,48.3 0 top
Q2  50.7,70.1 270 top
Q3  52.4,74.1 270 top
Q4  88.8,48.3 0 top
Q5  80.1,48.3 0 top
Q6  63.4,74.5 270 top
Q12  72.2,80.5 270 top
Q13  75.8,48.2 0 top
Q14  84.6,48.3 0 top
Q15  71.5,48.2 0 top
Q17  72.1,86 270 top
Q18  63.1,66.4 270 top
R1  16.5,83.5 270 top
R2  10.4,82.2 270 top
R9  55.8,73.6 270 top
R10  10,47.4 0 top
R11  10.4,86.5 270 top
R12  54.9,76.4 0 top
R13  19.5,84.1 270 top
R17  28.3,17.9 90 top
R18  6.5,40 0 top
R19  6.6,37 0 top
R21  28,31.6 270 top
R22  6.5,33.5 0 top
R23  6.6,30 0 top
R24  6.8,26.3 0 top
R25  6.8,22.6 0 top
R26  6.7,19.1 0 top
R27  40.8,94.7 180 top
R28  6.8,15 0 top
R30  31.8,79.2 0 bottom
R43  55.4,65.1 270 top
R44  54.6,68.9 0 top
RESET_SWITCH  46.5,95.8 90 bottom
SWDIO/SWDCLK/RESET  53.7,94.6 0 top
U$1  15.7,0 0 top
U$3  11.4,60.6 180 top
U$6  26.1,60.8 270 bottom
USB_ID/USB_DP/USB_DN  14.2,94.2 270 top
Y1  31.7,87.7 180 bottom
Y3  37.7,86.7 0 top

### Tracks (layer width: path | path; a pad name or v marks a point on that pad's centre or on a via)
+3V3  (via drill 0.35)
  Top 0.152: R27.2 40.85,95.6 52.16,95.6 SWDIO/SWDCLK/RESET.2 | 9.35,80.3 8.9,80.3 | 25.6,81.85 25.6,84.75 C1.1 | 25.2,72.3 25.1,72.2 C10.1 | 34.26,73.53 34.69,73.1 34.7,73.1 v34.7,71.8 | v34.1,70 34.2,69.9 C11.1
  Top 0.254: MC.13 27.77,82.99 27.77,82.24 27.38,81.85 26.02,80.48 | 26.02,80.48 25.68,80.15 MC.19 | 26.02,80.48 26.02,75.81 v26,75.8 | MC.64 35.02,81.15 34.76,80.89 34.76,80.86 v34.3,80.4 33.4,79.5 33.4,78.3 34.26,77.44 34.26,73.53 33.85,73.12 MC.48 | v25.8,72.9 25.2,72.3 24.8,72.3 24.43,72.67 MC.32
  Top 0.305: v37.6,81.99 36.76,81.15 MC.64
  Top 0.508: v49,14 25.4,14 v19,7.6 16.75,9.85 | v75.5,14.6 82.4,21.5 v82.4,37.9 | v81.5,50.2 81.5,53.34 ACTUATOR.16 | SWDIO/SWDCLK/RESET.2 SWDIO/SWDCLK/RESET.1 49.7,90.6 v46.1,90.6 | v43.1,88 v39.4,84.3
  Top 0.61: U$1.2 19,3.44 v19,7.6 | v28,81 28,81.23 27.38,81.85 25.6,81.85 22.65,81.85 21.1,80.3 8.9,80.3 6,80.3 1.2,75.5 1.2,13.7 5.05,9.85 16.75,9.85 | R2.2 9.35,80.3
  Bottom 0.152: C6.1 27.85,80.85 v28,81 | v34.7,71.8 34.7,71.2 34,70.5 34,70.1 v34.1,70
  Bottom 0.254: v26,75.8 26,74.6 25.8,74.4 v25.8,72.9 | v34.3,80.4 32.03,80.4 31.87,80.24 28.76,80.24 v28,81
  Bottom 0.508: v49,14 74.9,14 v75.5,14.6 | v82.4,37.9 84.5,40 84.5,47.2 v81.5,50.2 | v46.1,90.6 43.5,88 v43.1,88 | v39.4,84.3 37.6,82.5 v37.6,81.99
  pour Bottom (no thermals): 15.88,7.62 16.51,8.26 21.59,8.26 22.23,7.62 22.23,1.91 15.88,1.91
  pour Top (no thermals): 15.88,7.62 16.51,8.26 21.59,8.26 22.23,7.62 22.23,1.91 15.88,1.91
+5V  (via drill 0.35)
  Top 0.508: v93.2,60.2 97.5,55.9 97.5,52 96.1,50.6 96.1,32.7 v77,13.6 | v47.9,11.7 44.5,8.3 v44.5,7.6
  Bottom 0.508: ACTUATOR.15 84.17,60.2 v93.2,60.2 | v77,13.6 75.1,11.7 v47.9,11.7
  pour Top (no thermals): 41.15,1.78 41.15,7.62 41.78,8.26 47.12,8.26 47.75,7.62 47.75,1.78
  pour Bottom (no thermals): 41.15,1.78 41.15,7.62 41.78,8.26 47.12,8.26 47.75,7.62 47.75,1.78
+12V  (via drill 0.35)
  Top 1.016: ACTUATOR.9 75.16,90.2 v64.2,90.2 | D8.C 63.9,86 v62.1,87.8 v62.1,85 | v60,82.5 60,81.4 60.8,80.6 D9.C
  Top 1.27: U$3.1+ 8.8,63.2 8.8,74.9 v12.5,78.6 | v17.6,88.3 20.6,88.3 24,91.7 24,93.2 27.3,96.5 49.6,96.5 52.4,99.3 77.6,99.3 85,91.9 v85,88.5
  Bottom 1.016: v64.2,90.2 62.1,88.1 v62.1,87.8 | v62.1,85 60,82.9 v60,82.5
  Bottom 1.27: v12.5,78.6 14.4,80.5 14.4,86 16.7,88.3 v17.6,88.3 | ACTUATOR.9 83.19,83.27 85,85.08 v85,88.5
+24V  (via drill 0.35)
  Top 0.152: R9.2 58.07,72.75 Q6.2 | R43.2 58.17,64.25 Q18.2
  Top 1.27: D2.C D5.C D7.C D3.C D4.C D6.C 68.2,37.2 D10.C | v61.1,53.8 68.2,46.7 D10.C | v61.1,61.6 61.1,63 | 61.1,63 61.1,69.72 Q6.2 | 61.1,63 59.98,64.12 Q18.2 | DISCHARGING.A 28.3,28.1 R21.2 33.18,33.58 C4.+ 48.53,31.35 63.82,31.35 D10.C
  Bottom 1.27: v61.1,53.8 v61.1,61.6
AGND  (via drill 0.35, 1)
  Top 0.152: R19.1 5.55,36.9 v4,36.9 | USB_ID/USB_DP/USB_DN.GND 12.6,90.9 v11,89.3 | MC.63 36.95,80.65 37.2,80.9 37.8,80.9 | Q17.2 v71.1,83.5 | Q12.2 v71.2,77.9 | Q2.2 47.7,71.15 v47.7,71.8 | Q3.2 51.05,73.15 v49,75.2 | Q15.2 72.8,47.2 v73.5,46.5 | Q13.2 77.3,47.2 v78,46.5 | Q5.2 81.5,47.3 v82.3,46.5 | Q14.2 85.9,47.3 v86.6,46.6 | Q4.2 90.3,47.3 v91,46.6 | Q1.2 94.5,47.3 v95.1,46.7 | 37.8,80.9 40.8,80.9 46.6,75.1 v46.6,73.6 | MC.12 28.48,82.94 28.48,82.26 29.1,81.64 v29.1,81.5 | MC.18 24.3,80.52 23.62,80.52 23.5,80.4 v22.5,80.4 | v38.8,46.8 38.85,46.8 C5.2 | C13.2 v37.4,92.4 | C9.2 v39.8,92.5 | C3.2 33.6,91.1 v32.5,92.2 | C2.2 30.9,92.25 v30.9,92.3 | BATTERY.C 4.1,47.4 v3.6,47.9 | R28.1 v4.2,15 | R26.1 v4.1,19.1 | R25.1 v4.2,22.6 | R24.1 v4.2,26.3 | R23.1 v4,30 | R18.1 v3.9,40 | C1.2 23,85.2 v22.1,86.1 | 37.8,80.9 v38.89,81.99 v38.9,81.99 | C10.2 26.35,68.25 v26.4,68.2 | C11.2 38.4,69.9 v39.8,68.5 | R22.1 v4.4,33.5
  Top 0.2: C7.1 22.1,71.3 v23.4,70
  Top 0.61: USB_ID/USB_DP/USB_DN.S3 v8.1,97.2 | USB_ID/USB_DP/USB_DN.S4 9.4,91.4 v8.1,91.4 | USB_ID/USB_DP/USB_DN.S2 v20.3,91.7 | USB_ID/USB_DP/USB_DN.S1 v20.3,97.2
  Top 1.27: R17.1 v30.6,16.5 | D10.A v68.2,29.6
  other vias: 26.67,7.62 36.96,7.62
  pour Bottom (no thermals): 1.9,8.9 1.9,96.1 6,100.2 97.9,100.2 98,100.3 98,55.4 99.6,53.8 99.6,47.2 100.7,46.1 100.7,15.4 94.2,8.9
  pour Top (no thermals): 23.5,7.62 24.13,8.26 29.21,8.26 29.84,7.62 29.84,1.91 23.5,1.91
  pour Bottom (no thermals): 23.5,7.62 24.13,8.26 29.21,8.26 29.84,7.62 29.84,1.91 23.5,1.91
  pour Top (no thermals): 33.66,1.78 40.13,1.78 40.13,7.62 39.62,8.26 34.04,8.26 33.53,7.62 33.53,1.91
  pour Bottom (no thermals): 33.53,7.62 33.53,1.91 33.66,1.78 40.01,1.78 40.01,4.06 40.01,5.71 40.13,5.84 40.13,7.62 39.62,8.26 34.04,8.26
  pour Bottom: 23.6,10 29.7,10 29.8,9.9 29.8,7.5 29.6,7.3 24.3,7.3 24.2,7.4 24.2,9.5 23.8,9.9 23.7,9.9
  pour Bottom: 34,7.2 34,10.1 39.6,10.1 39.7,10 39.7,7.3 39.6,7.2
ARM_TORPEDO  (via drill 0.35)
  Top 0.2: U$6.P$3 33.28,62.9 v34.6,62.9 | v37.7,66.2 37.7,66.9 v36.6,68 | MC.39 29.46,71.62 29.46,70.91 30.47,69.9 v31.2,69.9
  Bottom 0.2: v34.6,62.9 37.7,66 v37.7,66.2 | v36.6,68 35.7,68.9 32.2,68.9 v31.2,69.9
COIL_1
  Top 0.508: D5.A Q4.3 88.8,52.73 ACTUATOR.8
COIL_1_GATE  (via drill 0.35)
  Top 0.152: Q4.1 87.85,50.25 v87.9,50.3 | v67.7,59.5 46.2,59.5 43.3,62.4 v43.3,77.1 | v40.7,79.59 40.64,79.65 MC.61
  Bottom 0.152: v87.9,50.3 87.9,51.4 83.6,55.7 78.2,55.7 74.4,59.5 v67.7,59.5 | v43.3,77.1 40.81,79.59 v40.7,79.59
COIL_2
  Top 0.508: D7.A 84.5,49.3 Q14.3 84.6,55.12 ACTUATOR.7
COIL_2_GATE  (via drill 0.35)
  Top 0.152: Q14.1 83.65,49.25 v83.1,49.8 | v69.6,58.4 46.2,58.4 42.4,62.2 42.4,78.8 41,80.2 35.82,80.2 MC.62
  Bottom 0.152: v83.1,49.8 74.8,58.1 69.9,58.1 v69.6,58.4
COIL_3
  Top 0.508: D3.A Q5.3 80.1,54.7 81.4,56 83.5,56 84.9,57.4 84.9,60 87.21,62.31 ACTUATOR.6
COIL_3_GATE  (via drill 0.35)
  Top 0.152: Q5.1 79.15,49.85 v79.1,49.9 | v65.3,57.5 45,57.5 35.4,67.1 v35.3,67.1 | v27.5,74.5 26.85,75.15 MC.29
  Bottom 0.152: v65.3,57.5 71.5,57.5 v79.1,49.9 | v35.3,67.1 34.2,68.2 30.1,68.2 27.5,70.8 v27.5,74.5
COIL_4
  Top 0.508: D4.A Q13.3 75.8,58.4 75.95,58.55 | ACTUATOR.5 85.2,64.11 85.2,62.5 83,60.3 77.7,60.3 75.95,58.55 | 75.95,58.55
COIL_4_GATE  (via drill 0.35)
  Top 0.152: Q13.1 74.85,49.95 v74.8,50 | v64,56.4 44.3,56.4 33.4,67.3 v29.7,67.3 | v26.6,74 25.95,74.65 MC.30
  Bottom 0.152: v64,56.4 68.4,56.4 v74.8,50 | v29.7,67.3 26.6,70.4 v26.6,74
COIL_5  (via drill 0.35)
  Top 0.508: D6.A Q15.3 71.5,62.1 73.8,64.4 v77.3,64.4 | ACTUATOR.4 84.3,67.39 v84.3,65.1
  Bottom 0.508: v84.3,65.1 83.6,64.4 v77.3,64.4
COIL_5_GATE  (via drill 0.35)
  Top 0.152: Q15.1 70.55,50.25 v70.5,50.3 | v64.8,55.3 43.9,55.3 32.9,66.3 29.6,66.3 26.35,69.55 MC.33
  Bottom 0.152: v64.8,55.3 65.5,55.3 v70.5,50.3
COIL_S
  Top 0.508: D2.A Q1.3 93.1,52.8 91.6,54.3 91.6,71.3 88.01,74.89 ACTUATOR.3
COIL_S_GATE  (via drill 0.35)
  Top 0.152: Q1.1 92.15,50.45 v92.2,50.5 | MC.34 26.98,71.6 26.98,70.12 28,69.1 38,69.1 v41.6,65.5 | v69.2,60.5 46.6,60.5 v44.3,62.8
  Bottom 0.152: v92.2,50.5 92.2,52.5 88.3,56.4 78.5,56.4 74.4,60.5 v69.2,60.5 | v44.3,62.8 v41.6,65.5
DROPPER1
  Top 0.61: ACTUATOR.10 75.17,86 Q17.3 D8.A
DROPPER1_GATE  (via drill 0.35)
  Top 0.152: Q17.1 69.35,88.7 v41.4,88.7 | v31.6,80.9 31.6,80.3 28.4,77.1 28.4,74.2 27.35,73.15 MC.35
  Bottom 0.152: v41.4,88.7 33.6,80.9 v31.6,80.9
DROPPER2
  Top 0.508: D9.A 73.2,80.6 Q12.3
  Top 0.61: ACTUATOR.11 82.09,75.39 76.97,80.5 Q12.3
DROPPER2_GATE
  Top 0.152: Q12.1 69.05,83.6 35.8,83.6 31.9,79.7 31.9,77 27.85,72.95 MC.36
EXTRA1  (via drill 0.35)
  Top 0.152: v41,37.9 41,54.8 v39.2,56.6 | v39.1,70.4 39.1,73.6 37.55,75.15 MC.52 | v47.6,17 v41.8,22.8
  Bottom 0.152: U$1.28 85.11,9.29 78.7,15.7 48.9,15.7 v47.6,17 | v41,37.9 41,23.6 v41.8,22.8 | v39.2,56.6 39.1,56.7 v39.1,70.4
EXTRA2  (via drill 0.35)
  Top 0.152: U$1.33 74.94,7.35 60.1,22.2 v60.1,27 | v60.1,36.8 60.1,47.6 54.1,53.6 v54.1,54.2 | v39.1,75.4 38.85,75.65 MC.53 | v53.8,61.5 44.5,70.8 v44.2,70.8
  Bottom 0.152: v60.1,27 v60.1,36.8 | v53.8,61.5 54.1,61.2 v54.1,54.2 | v44.2,70.8 39.6,75.4 v39.1,75.4
EXTRA3  (via drill 0.35)
  Top 0.152: U$1.34 72.41,7.5 58.2,21.7 v58.2,26.9 | v58.2,34.5 58.2,46.9 52.2,52.9 v52.2,53.8 | v39.9,72.9 39.9,75.5 39.25,76.15 MC.54 | v51.7,61.5 v44.1,69.1
  Bottom 0.152: v58.2,26.9 v58.2,34.5 | v51.7,61.5 52.2,61 v52.2,53.8 | v44.1,69.1 41.1,72.1 40.7,72.1 v39.9,72.9
EXTRA4  (via drill 0.35)
  Top 0.152: U$1.43 49.55,11.55 50.6,12.6 v50.6,26.7 | v50.7,34.6 50.7,46.5 v37.7,59.5 | MC.51 35.9,74.52 37.38,74.52 38.5,73.4 38.5,71.5 v38.4,71.4
  Bottom 0.152: v50.7,34.6 50.7,26.8 v50.6,26.7 | v37.7,59.5 38.4,60.2 v38.4,71.4
EXTRA5  (via drill 0.35)
  Top 0.152: U$1.36 67.22,3.48 67.22,7.38 53.4,21.2 v53.4,26.7 | v53.4,34.6 53.4,46.9 v47.1,53.2 | v41.7,68.6 41.7,75.5 40.05,77.15 MC.56 | v47.1,61.2 47.1,62.1 v44.1,65.1
  Bottom 0.152: v53.4,26.7 v53.4,34.6 | v47.1,53.2 v47.1,61.2 | v44.1,65.1 41.7,67.5 v41.7,68.6
EXTRA6  (via drill 0.35)
  Top 0.152: U$1.35 69.86,7.63 55.9,21.6 v55.9,26.9 | v55.9,34.5 55.9,46.9 v49.8,53 | v40.8,70.9 40.8,75.5 39.65,76.65 MC.55 | v49.8,61.4 44.1,67.1 v44.1,67.3
  Bottom 0.152: v55.9,26.9 v55.9,34.5 | v49.8,53 v49.8,61.4 | v44.1,67.3 40.8,70.6 v40.8,70.9
LED1
  Top 0.152: LIGHT1.A 13.85,43 13.85,71.85 21.7,79.7 24.38,79.7 MC.20
LED2
  Top 0.152: LIGHT2.A 15.2,41.55 15.2,72.33 22.02,79.15 MC.21
LED3
  Top 0.152: LIGHT3.A 16.6,38.95 16.6,73.3 22,78.7 24.38,78.7 MC.22
LED4
  Top 0.152: LIGHT4.A 18,37.05 18,74.2 21.95,78.15 MC.23
LED5
  Top 0.152: LIGHT5.A 19.4,35.65 19.4,65.3 19.37,65.33 19.37,75.07 21.95,77.65 MC.24
LED6
  Top 0.152: LIGHT6.A 21,34.75 21,68.53 19.67,69.86 19.67,74.77 22.05,77.15 MC.25
LED7
  Top 0.152: LIGHT7.A 11.2,22.25 11.5,22.25 | 22.6,58 22.6,61.7
  Top 0.2: 11.5,22.25 22.6,33.35 22.6,58 | 22.6,61.7 22.6,68.3 20,70.9 20,74.5 22.15,76.65 MC.26
LED8
  Top 0.152: MC.27 22.25,76.15 20.7,74.6 20.7,71.7 23.9,68.5 23.9,31.4 12.2,19.7 LIGHT8.A
N$1
  Top 0.152: C2.1 27.85,89.01 Y1.1 31.35,85.51 MC.6
N$2
  Top 0.152: C3.1 35.55,89.01 Y1.2 31.85,85.31 MC.5
N$3  (via drill 0.35)
  Top 0.152: v33.3,73.5 33.3,71.78 MC.47
  Bottom 0.152: C8.2 32,74.8 v33.3,73.5
N$5
  Top 0.152: MC.4 32.35,84.35 32.9,84.9 33.2,84.9 35,86.7 Y3.P$1 36.45,88.5 C13.1
N$6
  Top 0.2: R11.1 10.85,87.35 13.4,89.9 USB_ID/USB_DP/USB_DN.ID
N$7
  Top 0.2: USB_ID/USB_DP/USB_DN.D+ 14.2,88.15 16.5,85.85 R1.1
N$8
  Top 0.2: R13.1 15.05,89.4 15.05,91.65 USB_ID/USB_DP/USB_DN.D-
N$9
  Top 0.2: R10.1 BATTERY.A
N$11
  Top 0.152: C7.2 MC.31
N$14
  Top 0.152: R44.1 53,68.9 Q2.3
N$15
  Top 1.27: DISCHARGING.C R17.2
N$16
  Top 0.152: R18.2 LIGHT1.C
N$17
  Top 0.152: R19.2 9.15,37 LIGHT2.C
N$18
  Top 0.152: R22.2 LIGHT3.C
N$19
  Top 0.152: R23.2 9.45,30 LIGHT4.C
N$20
  Top 0.152: R43.1 55.4,68.85 R44.2 58.08,68.9 Q18.1
N$21
  Top 0.152: R24.2 8.55,26.3 LIGHT5.C
N$22
  Top 0.152: LIGHT6.C 7.65,22.9 R25.2
N$23
  Top 0.152: LIGHT7.C 9.65,21.4 7.55,19.3 R26.2
N$24
  Top 0.152: R28.2 7.65,15.66 9.65,17.62 LIGHT8.C
N$25
  Top 0.152: R9.1 55.75,74.5 R12.2 56.13,76.78 Q6.1
N$26
  Top 1.27: R21.1 30.5,34.8 37,41.3 C5.1 32.3,48.1 U$6.P$6
N$28
  Top 0.152: Q3.3 54.05,74.65 R12.1
N$29
  Top 0.152: MC.3 32.85,83.95 34.2,85.3 37.55,85.3 Y3.P$2 39.8,87.55 C9.1
N$30  (via drill 0.35)
  Top 0.152: v34.1,79.2 35.72,79.2 MC.60
  Bottom 0.152: R30.1 v34.1,79.2
PWM_CLAW  (via drill 0.35)
  Top 0.152: ACTUATOR.1 86.3,83.27 77.57,92 53.1,92 50.4,89.3 42.8,89.3 v42.2,89.9 | v28.1,84.6 27.9,84.6 27.35,84.05 MC.14
  Bottom 0.152: v42.2,89.9 42.2,89.88 39.28,89.88 34,84.6 v28.1,84.6
RESET
  Top 0.152: 43.24,93.45 43.34,93.45 RESET_SWITCH.3 44.24,90.86 45.3,89.8 49.91,89.8 52.81,92.7 69.58,92.7 SWDIO/SWDCLK/RESET.15 | 43.24,93.45 27.05,93.45 25.3,91.7 25.3,90.07 30.85,84.52 MC.7 | R27.1 42.1,94.59 43.24,93.45
SCL  (via drill 0.35)
  Top 0.152: U$1.31 80,3.4 80,8.4 66.4,22 v62.2,22 | v61.2,39.2 61.2,47.7 v56.5,52.4 | v39.5,77.9 39.25,78.15 MC.58 | v53.7,63.3 44.2,72.8 v44.2,73.5
  Bottom 0.152: v62.2,22 61.2,23 v61.2,39.2 | v56.5,52.4 55.2,53.7 55.2,62.2 54.1,63.3 v53.7,63.3 | v44.2,73.5 39.8,77.9 v39.5,77.9
SDA  (via drill 0.35)
  Top 0.152: MC.59 35.82,78.6 40.8,78.6 v41.7,77.7 | U$1.32 77.49,8.21 v64.7,21 | v62.3,37.5 62.3,47.7 v56.3,53.7 | v56.3,61.9 49.68,68.52 49.16,68.52 45,72.68 v45,74.8
  Bottom 0.152: v64.7,21 62.3,23.4 v62.3,37.5 | v56.3,53.7 v56.3,61.9 | v45,74.8 43.31,76.49 43.05,76.49 41.84,77.7 v41.7,77.7
SWD_CLK  (via drill 0.35)
  Top 0.152: v37.8,73.1 37.5,72.8 36.2,72.8 35.77,73.23 MC.49 | v55.8,86.9 45.6,86.9 v43.5,84.8
  Bottom 0.152: v37.8,73.1 37.8,77.8 38.6,78.6 39.2,78.6 39.7,79.1 39.7,79.74 43.5,83.54 v43.5,84.8 | SWDIO/SWDCLK/RESET.9 56.16,86.9 v55.8,86.9
SWD_IO  (via drill 0.35)
  Top 0.152: v36.3,72 36.3,71.4 35.6,70.7 33.2,70.7 32.85,71.05 MC.46 | v54.7,87.9 45.32,87.9 v41.8,84.38
  Bottom 0.152: v41.8,84.38 41.8,82.7 36.1,77 36.1,72.2 v36.3,72 | v54.7,87.9 54.7,87.98 SWDIO/SWDCLK/RESET.7
TORPEDO1
  Top 1.27: ACTUATOR.14 78,66.4 Q18.3
TORPEDO1_GATE
  Top 0.152: Q2.1 49.7,72.8 39.9,82.6 35.6,82.6 32.51,79.51 32.51,76.75 28.35,72.59 MC.37
TORPEDO2
  Top 1.27: ACTUATOR.13 74.09,74.5 Q6.3
TORPEDO2_GATE  (via drill 0.35)
  Top 0.152: Q3.1 43.75,82.7 v40.7,82.7 | v33.6,74.9 33,74.3 30.74,74.3 28.85,72.41 MC.38
  Bottom 0.152: v40.7,82.7 33.6,75.6 v33.6,74.9
USB_DN  (via drill 0.35)
  Top 0.152: R13.2 v19.5,81.9 | v30.5,73.2 31.4,73.2 31.85,72.75 MC.44
  Bottom 0.152: v30.5,73.2 27.2,76.5 24.9,76.5 v19.5,81.9
USB_DP  (via drill 0.35)
  Top 0.152: R1.2 18.25,80.91 20.5,80.91 v21.3,81.7 | v32,73.69 32.35,73.34 MC.45
  Bottom 0.152: v21.3,81.7 23.99,81.7 v32,73.69
USB_ID
  Top 0.2: R11.2 R2.1
V+
  Top 0.508: U$3.3+ R10.2
  Top 1.27: U$3.3+ U$3.2+
  Bottom 1.27: U$3.2+ 13.26,58.26 U$6.P$2

### Text on the board
tPlace: Actuator | The Underwater Robotics Team / Center for Automotive Research
tNames: Dropper | Torpedo | Coils | U$3
Reference: GND | 3.3V | SWDIO | SWCLK | RESET